# EAGLE schematic remote_v0.9.a8132eb9 (EAGLE 7.7.0)
I2C Bus Components - Dual DAC - Voltage Monitoring - Temperature Sensors - I/O Expander
VERSION: V0.1
Assembly variants: Beta, Min

## Sheet 1 of 4
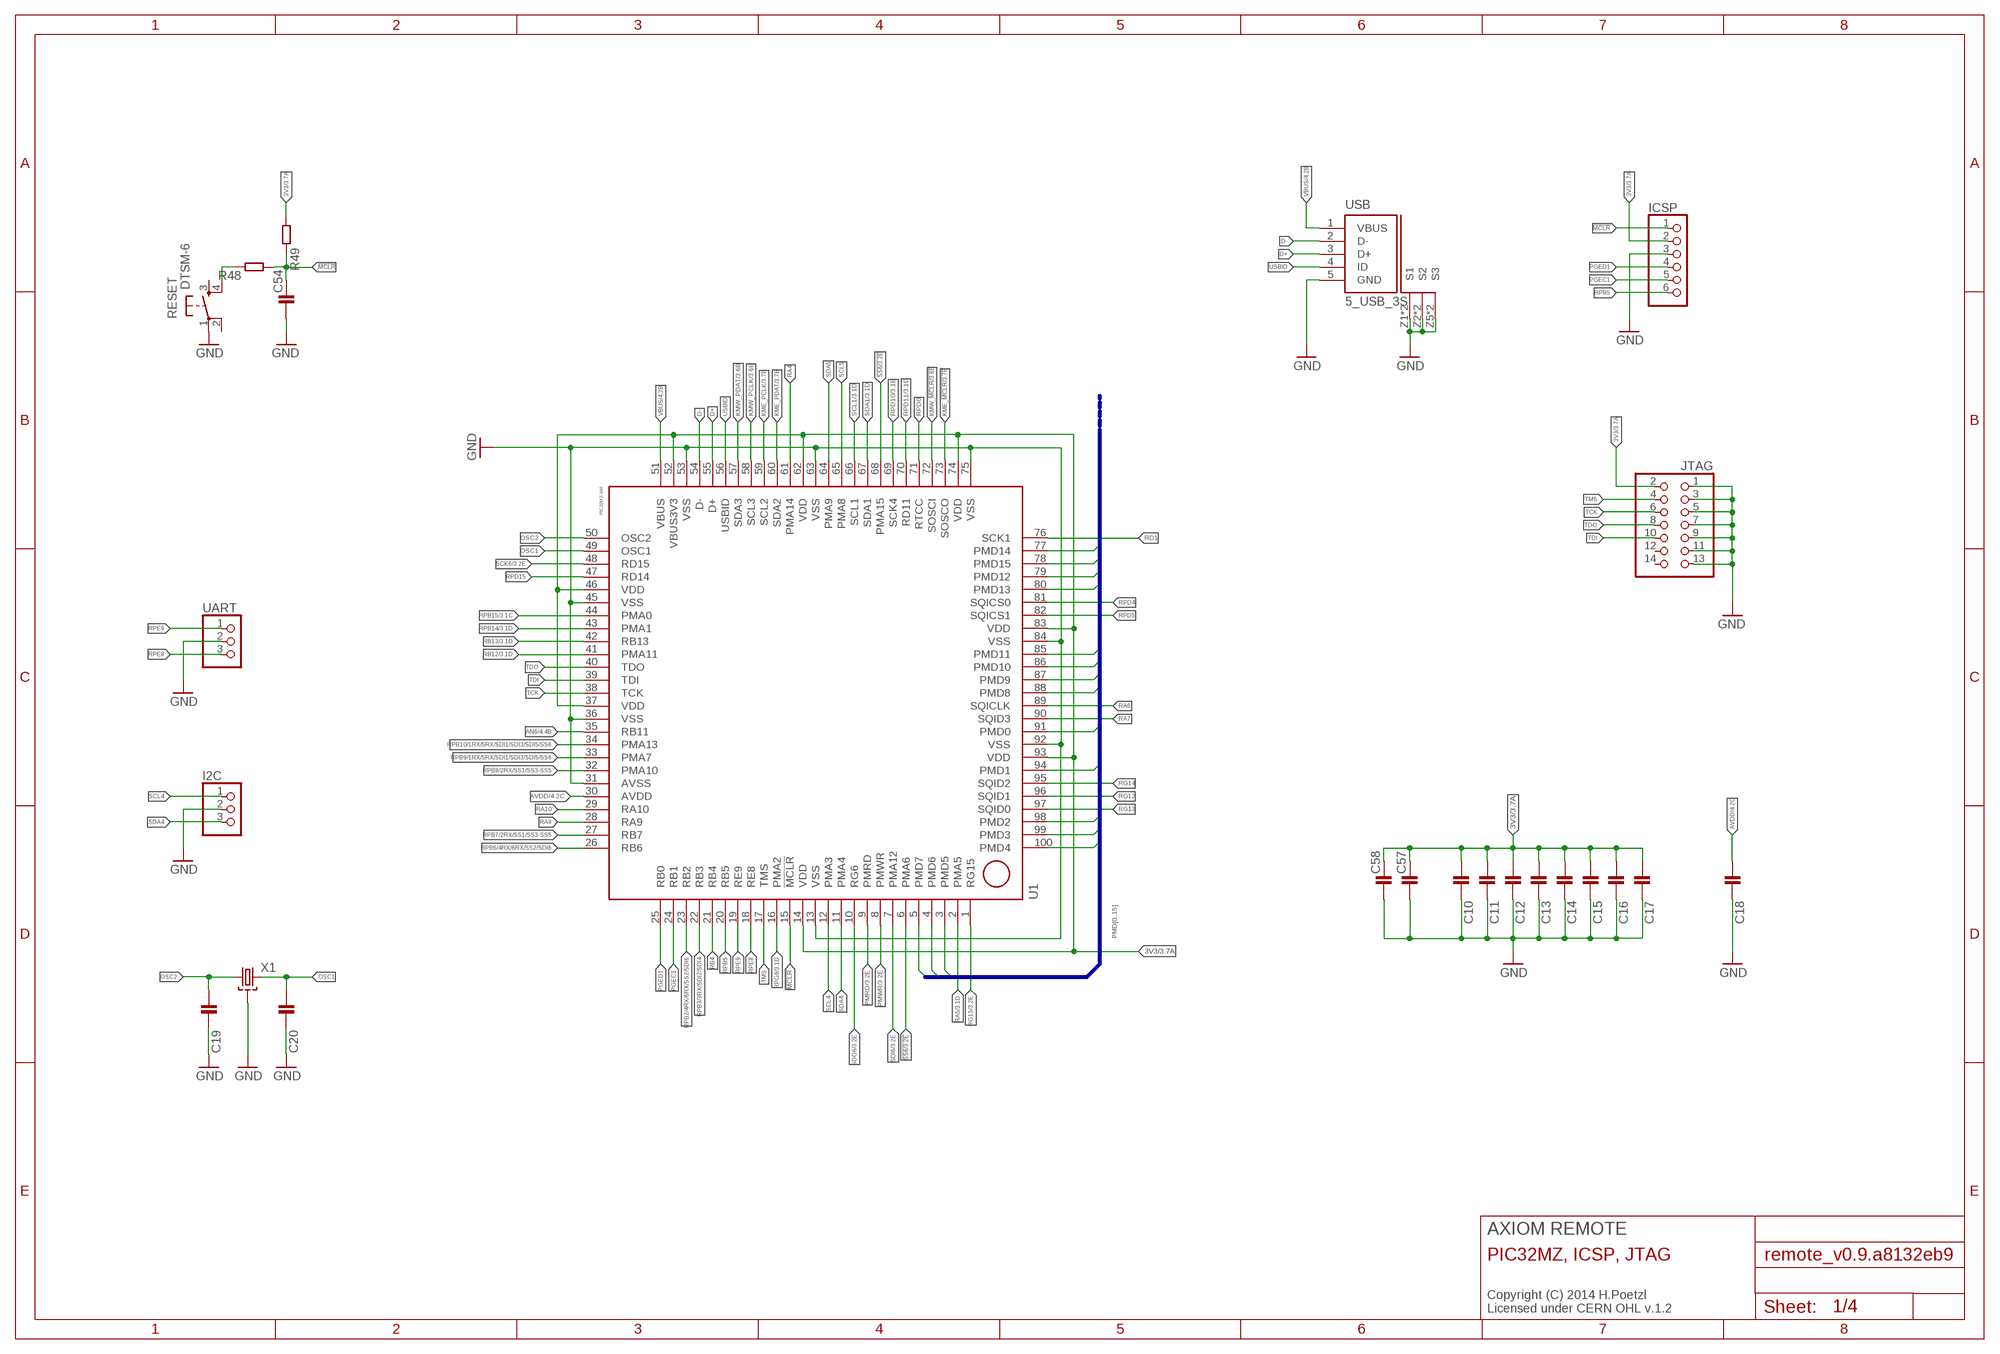
[diagram p0: schematic, sheet 1]

### Parts
C10  100n  C0402-C  [0402-C]
C11  100n  C0402-C  [0402-C]
C12  100n  C0402-C  [0402-C]
C13  100n  C0402-C  [0402-C]
C14  100n  C0402-C  [0402-C]
C15  100n  C0402-C  [0402-C]
C16  100n  C0402-C  [0402-C]
C17  100n  C0402-C  [0402-C]
C18  100n  C0402-C  [0402-C]
C19  100n  C0402-C  [0402-C]
C20  100n  C0402-C  [0402-C]
C54  C0402-C  [0402-C]
C57  C0805-C  [0805-C]
C58  C0805-C  [0805-C]
I2C  PINHD-1X03_2.54-90°  [1X03/90]
ICSP  PINHD-1X6/90  [1X06/90]
JTAG  PINHD-2X07_2.00  [2X07M]
R48  R0402-C  [0402-C]
R49  R0402-C  [0402-C]
RESET  DTSM-6  [3X4MM]
U1  PIC32MZ-100  [QFP40P1400X1400X120-100N]
UART  PINHD-1X03_2.54-90°  [1X03/90]
USB  5_USB_3S  [MICRO-AB-H-SMT]
X1  SMD-4P-2G-2.0X1.6  [2.0X1.6]

### Nets
3V3: C10.1 C11.1 C12.1 C13.1 C14.1 C15.1 C16.1 C17.1 C57.1 C58.1 ICSP.2 JTAG.2 R49.2 U1.14(VDD) U1.37(VDD) U1.46(VDD) U1.52(VBUS3V3) U1.62(VDD) U1.74(VDD) U1.83(VDD) U1.93(VDD) ; also sheet 3,4
!MCLR: C54.1 ICSP.1 R48.2 R49.1 U1.15(!MCLR)
!SS6: U1.6(PMA6) U1.68(PMA15) ; also sheet 3
AN6: U1.35(RB11) ; also sheet 4
AVDD: C18.1 U1.30(AVDD) ; also sheet 4
D+: U1.55(D+) USB.3(D+)
D-: U1.54(D-) USB.2(D-)
GND: C10.2 C11.2 C12.2 C13.2 C14.2 C15.2 C16.2 C17.2 C18.2 C19.2 C20.2 C54.2 C57.2 C58.2 I2C.2 ICSP.3 JTAG.1 JTAG.3 JTAG.5 JTAG.7 JTAG.9 JTAG.11 JTAG.13 RESET.1 U1.13(VSS) U1.31(AVSS) U1.36(VSS) U1.45(VSS) U1.53(VSS) U1.63(VSS) U1.75(VSS) U1.84(VSS) U1.92(VSS) UART.2 USB.5(GND) USB.Z1(S1) USB.Z2(S2) USB.Z3(S2) USB.Z4(S1) USB.Z5(S3) USB.Z6(S3) X1.2(GND) X1.4(GND) ; also sheet 2,3,4
KME_!MCLR: U1.73(SOSCO) ; also sheet 3
KME_PCLK: U1.59(SCL2) ; also sheet 3
KME_PDAT: U1.60(SDA2) ; also sheet 3
KMW_!MCLR: U1.72(SOSCI) ; also sheet 3
KMW_PCLK: U1.58(SCL3) ; also sheet 3
KMW_PDAT: U1.57(SDA3) ; also sheet 3
N$45: R48.1 RESET.4
OSC1: C20.1 U1.49(OSC1) X1.3
OSC2: C19.1 U1.50(OSC2) X1.1
PGEC1: ICSP.5 U1.24(RB1)
PGED1: ICSP.4 U1.25(RB0)
PMD0: U1.91(PMD0) ; also sheet 3
PMD1: U1.94(PMD1) ; also sheet 3
PMD2: U1.98(PMD2) ; also sheet 3
PMD3: U1.99(PMD3) ; also sheet 3
PMD4: U1.100(PMD4) ; also sheet 3
PMD5: U1.3(PMD5) ; also sheet 3
PMD6: U1.4(PMD6) ; also sheet 3
PMD7: U1.5(PMD7) ; also sheet 3
PMD8: U1.88(PMD8) ; also sheet 3
PMD9: U1.87(PMD9) ; also sheet 3
PMD10: U1.86(PMD10) ; also sheet 3
PMD11: U1.85(PMD11) ; also sheet 3
PMD12: U1.79(PMD12) ; also sheet 3
PMD13: U1.80(PMD13) ; also sheet 3
PMD14: U1.77(PMD14) ; also sheet 3
PMD15: U1.78(PMD15) ; also sheet 3
PMRD: U1.9(PMRD) ; also sheet 3
PMWR: U1.8(PMWR) ; also sheet 3
RA4: U1.61(PMA14)
RA5: U1.2(PMA5) ; also sheet 3
RA6: U1.89(SQICLK)
RA7: U1.90(SQID3)
RA9: U1.28(RA9)
RA10: U1.29(RA10)
RB4: U1.21(RB4)
RB12: U1.41(PMA11) ; also sheet 3
RB13: U1.42(RB13) ; also sheet 3
RD1: U1.76(SCK1)
RG12: U1.96(SQID1)
RG13: U1.97(SQID0)
RG14: U1.95(SQID2)
RG15: U1.1(RG15) ; also sheet 3
RPB2/4RX/6RX/SS2/SDI6: U1.23(RB2)
RPB3/3RX/SDI2/SDI4: U1.22(RB3)
RPB5: ICSP.6 U1.20(RB5)
RPB6/4RX/6RX/SS2/SDI6: U1.26(RB6)
RPB7/2RX/SS1/SS3-SS5: U1.27(RB7)
RPB8/2RX/SS1/SS3-SS5: U1.32(PMA10)
RPB9/1RX/5RX/SDI1/SDI3/SDI5/SS6: U1.33(PMA7)
RPB10/1RX/5RX/SDI1/SDI3/SDI5/SS6: U1.34(PMA13)
RPB14: U1.43(PMA1) ; also sheet 3
RPB15: U1.44(PMA0) ; also sheet 3
RPD0: U1.71(RTCC)
RPD4: U1.81(SQICS0)
RPD5: U1.82(SQICS1)
RPD10: U1.69(SCK4) ; also sheet 3
RPD11: U1.70(RD11) ; also sheet 3
RPD15: U1.47(RD14)
RPE8: U1.18(RE8) UART.3
RPE9: U1.19(RE9) UART.1
RPG9: U1.16(PMA2) ; also sheet 3
SCK6: U1.48(RD15) ; also sheet 3
SCL1: U1.66(SCL1) ; also sheet 3
SCL4: I2C.1 U1.12(PMA3)
SCL5: U1.65(PMA8)
SDA1: U1.67(SDA1) ; also sheet 3
SDA4: I2C.3 U1.11(PMA4)
SDA5: U1.64(PMA9)
SDI6: U1.7(PMA12) ; also sheet 3
SDO6: U1.10(RG6) ; also sheet 3
TCK: JTAG.6 U1.38(TCK)
TDI: JTAG.10 U1.39(TDI)
TDO: JTAG.8 U1.40(TDO)
TMS: JTAG.4 U1.17(TMS)
USBID: U1.56(USBID) USB.4(ID)
VBUS: U1.51(VBUS) USB.1(VBUS) ; also sheet 4
Unconnected: JTAG.12 JTAG.14 RESET.2 RESET.3

### Buses
PMD[0..15]

### Notes on the sheet
- AXIOM REMOTE
- PIC32MZ, ICSP, JTAG
- Copyright (C) 2014 H.Poetzl
  Licensed under CERN OHL v.1.2

## Sheet 2 of 4
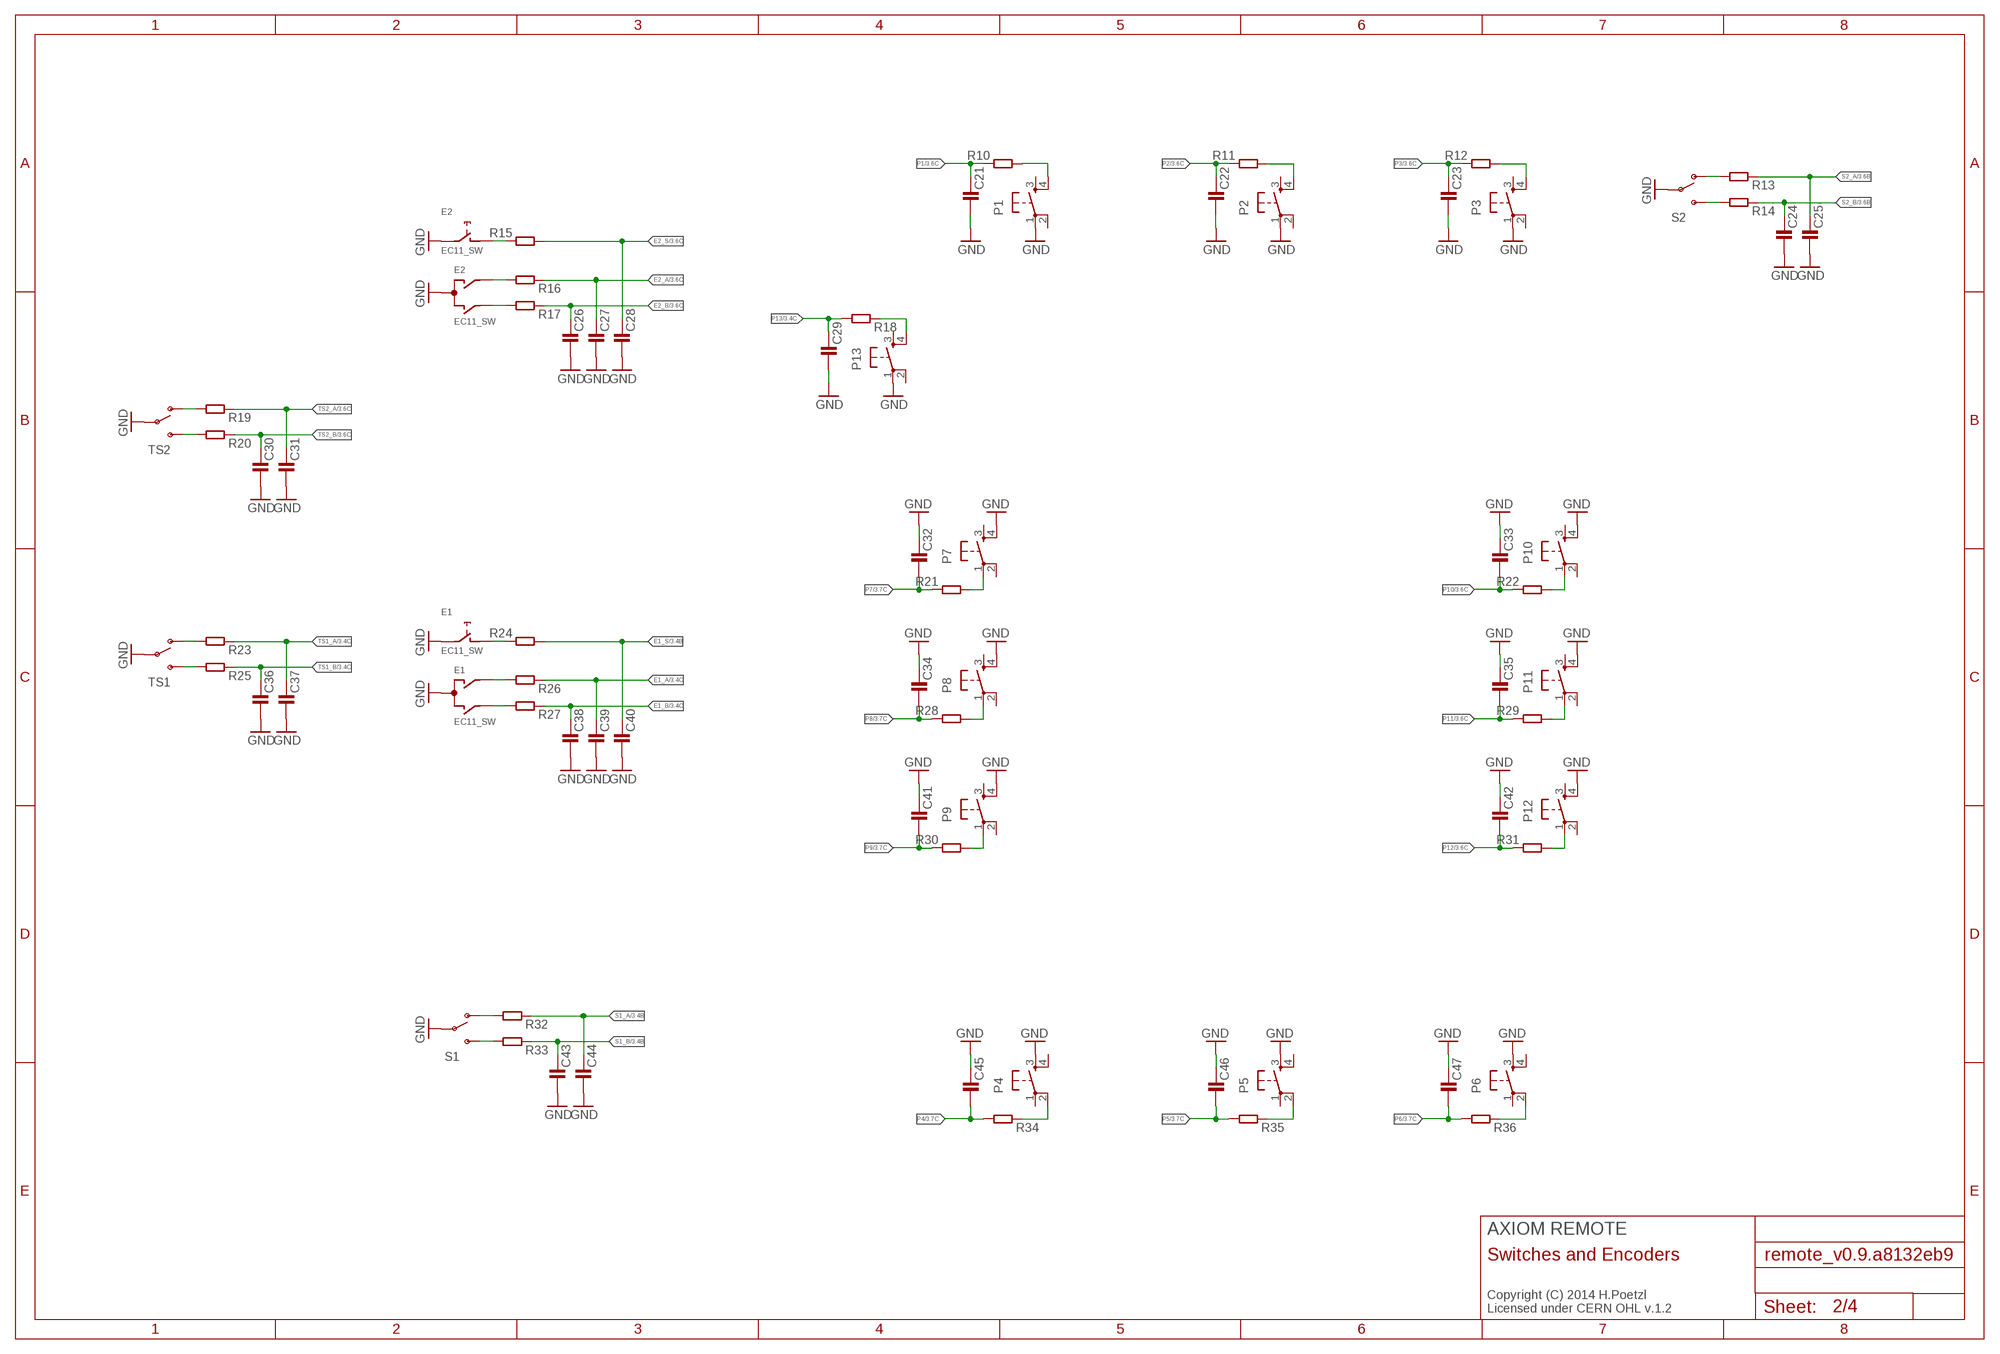
[diagram p1: schematic, sheet 2]

### Parts
C21  C0402-C  [0402-C]
C22  C0402-C  [0402-C]
C23  C0402-C  [0402-C]
C24  C0402-C  [0402-C]
C25  C0402-C  [0402-C]
C26  C0402-C  [0402-C]
C27  C0402-C  [0402-C]
C28  C0402-C  [0402-C]
C29  C0402-C  [0402-C]
C30  C0402-C  [0402-C]
C31  C0402-C  [0402-C]
C32  C0402-C  [0402-C]
C33  C0402-C  [0402-C]
C34  C0402-C  [0402-C]
C35  C0402-C  [0402-C]
C36  C0402-C  [0402-C]
C37  C0402-C  [0402-C]
C38  C0402-C  [0402-C]
C39  C0402-C  [0402-C]
C40  C0402-C  [0402-C]
C41  C0402-C  [0402-C]
C42  C0402-C  [0402-C]
C43  C0402-C  [0402-C]
C44  C0402-C  [0402-C]
C45  C0402-C  [0402-C]
C46  C0402-C  [0402-C]
C47  C0402-C  [0402-C]
E1  EC11_SW  [EC11_SW]
E2  EC11_SW  [EC11_SW]
P1  DTSM-6THT  [6X6-THT]
P2  DTSM-6THT  [6X6-THT]
P3  DTSM-6THT  [6X6-THT]
P4  DTSM-6THT  [6X6-THT]
P5  DTSM-6THT  [6X6-THT]
P6  DTSM-6THT  [6X6-THT]
P7  DTSM-6THT  [6X6-THT]
P8  DTSM-6THT  [6X6-THT]
P9  DTSM-6THT  [6X6-THT]
P10  DTSM-6THT  [6X6-THT]
P11  DTSM-6THT  [6X6-THT]
P12  DTSM-6THT  [6X6-THT]
P13  DTSM-6THT  [6X6-THT]
R10  R0402-C  [0402-C]
R11  R0402-C  [0402-C]
R12  R0402-C  [0402-C]
R13  R0402-C  [0402-C]
R14  R0402-C  [0402-C]
R15  R0402-C  [0402-C]
R16  R0402-C  [0402-C]
R17  R0402-C  [0402-C]
R18  R0402-C  [0402-C]
R19  R0402-C  [0402-C]
R20  R0402-C  [0402-C]
R21  R0402-C  [0402-C]
R22  R0402-C  [0402-C]
R23  R0402-C  [0402-C]
R24  R0402-C  [0402-C]
R25  R0402-C  [0402-C]
R26  R0402-C  [0402-C]
R27  R0402-C  [0402-C]
R28  R0402-C  [0402-C]
R29  R0402-C  [0402-C]
R30  R0402-C  [0402-C]
R31  R0402-C  [0402-C]
R32  R0402-C  [0402-C]
R33  R0402-C  [0402-C]
R34  R0402-C  [0402-C]
R35  R0402-C  [0402-C]
R36  R0402-C  [0402-C]
S1  SWITCH-SPDTTHT  [1101M2S3CBE2]
S2  SWITCH-SPDTTHT-RA  [1101M2S3ABE2]
TS1  SWITCH-SPDTSTG-RA  [200SPXTXBXM6]
TS2  SWITCH-SPDTSTG-RA  [200SPXTXBXM6]

### Nets
E1_A: C39.1 R26.1 ; also sheet 3
E1_B: C38.1 R27.1 ; also sheet 3
E1_S: C40.1 R24.2 ; also sheet 3
E2_A: C27.1 R16.1 ; also sheet 3
E2_B: C26.1 R17.1 ; also sheet 3
E2_S: C28.1 R15.2 ; also sheet 3
GND: C21.2 C22.2 C23.2 C24.2 C25.2 C26.2 C27.2 C28.2 C29.2 C30.2 C31.2 C32.1 C33.1 C34.1 C35.1 C36.2 C37.2 C38.2 C39.2 C40.2 C41.1 C42.1 C43.2 C44.2 C45.1 C46.1 C47.1 E1.C(E:C) E1.E E2.C(E:C) E2.E P1.1 P2.1 P3.1 P4.3 P5.3 P6.3 P7.4 P8.4 P9.4 P10.4 P11.4 P12.4 P13.1 S1.2(P) S2.2(P) TS1.2(P) TS2.2(P) ; also sheet 1,3,4
N$2: E2.A(E:A) R16.2
N$3: P1.4 R10.2
N$5: E2.B(E:B) R17.2
N$6: P2.4 R11.2
N$7: P3.4 R12.2
N$8: E2.D R15.1
N$10: R19.2 TS2.1(O)
N$11: R20.2 TS2.3(S)
N$13: R23.2 TS1.1(O)
N$14: R25.2 TS1.3(S)
N$15: R13.2 S2.1(O)
N$16: R14.2 S2.3(S)
N$17: E1.A(E:A) R26.2
N$18: E1.B(E:B) R27.2
N$19: E1.D R24.1
N$20: R32.2 S1.1(O)
N$21: R33.2 S1.3(S)
N$22: P4.2 R34.1
N$23: P5.2 R35.1
N$24: P6.2 R36.1
N$25: P9.1 R30.2
N$26: P12.1 R31.2
N$27: P8.1 R28.2
N$28: P11.1 R29.2
N$29: P7.1 R21.2
N$30: P10.1 R22.2
N$43: P13.4 R18.1
P1: C21.1 R10.1 ; also sheet 3
P2: C22.1 R11.1 ; also sheet 3
P3: C23.1 R12.1 ; also sheet 3
P4: C45.2 R34.2 ; also sheet 3
P5: C46.2 R35.2 ; also sheet 3
P6: C47.2 R36.2 ; also sheet 3
P7: C32.2 R21.1 ; also sheet 3
P8: C34.2 R28.1 ; also sheet 3
P9: C41.2 R30.1 ; also sheet 3
P10: C33.2 R22.1 ; also sheet 3
P11: C35.2 R29.1 ; also sheet 3
P12: C42.2 R31.1 ; also sheet 3
P13: C29.1 R18.2 ; also sheet 3
S1_A: C44.1 R32.1 ; also sheet 3
S1_B: C43.1 R33.1 ; also sheet 3
S2_A: C25.1 R13.1 ; also sheet 3
S2_B: C24.1 R14.1 ; also sheet 3
TS1_A: C37.1 R23.1 ; also sheet 3
TS1_B: C36.1 R25.1 ; also sheet 3
TS2_A: C31.1 R19.1 ; also sheet 3
TS2_B: C30.1 R20.1 ; also sheet 3
Unconnected: E1.GND1(GND1:G) E1.GND2(GND2:G) E2.GND1(GND1:G) E2.GND2(GND2:G) P1.2 P1.3 P2.2 P2.3 P3.2 P3.3 P4.1 P4.4 P5.1 P5.4 P6.1 P6.4 P7.2 P7.3 P8.2 P8.3 P9.2 P9.3 P10.2 P10.3 P11.2 P11.3 P12.2 P12.3 P13.2 P13.3

### Notes on the sheet
- AXIOM REMOTE
- Switches and Encoders
- Copyright (C) 2014 H.Poetzl
  Licensed under CERN OHL v.1.2

## Sheet 3 of 4
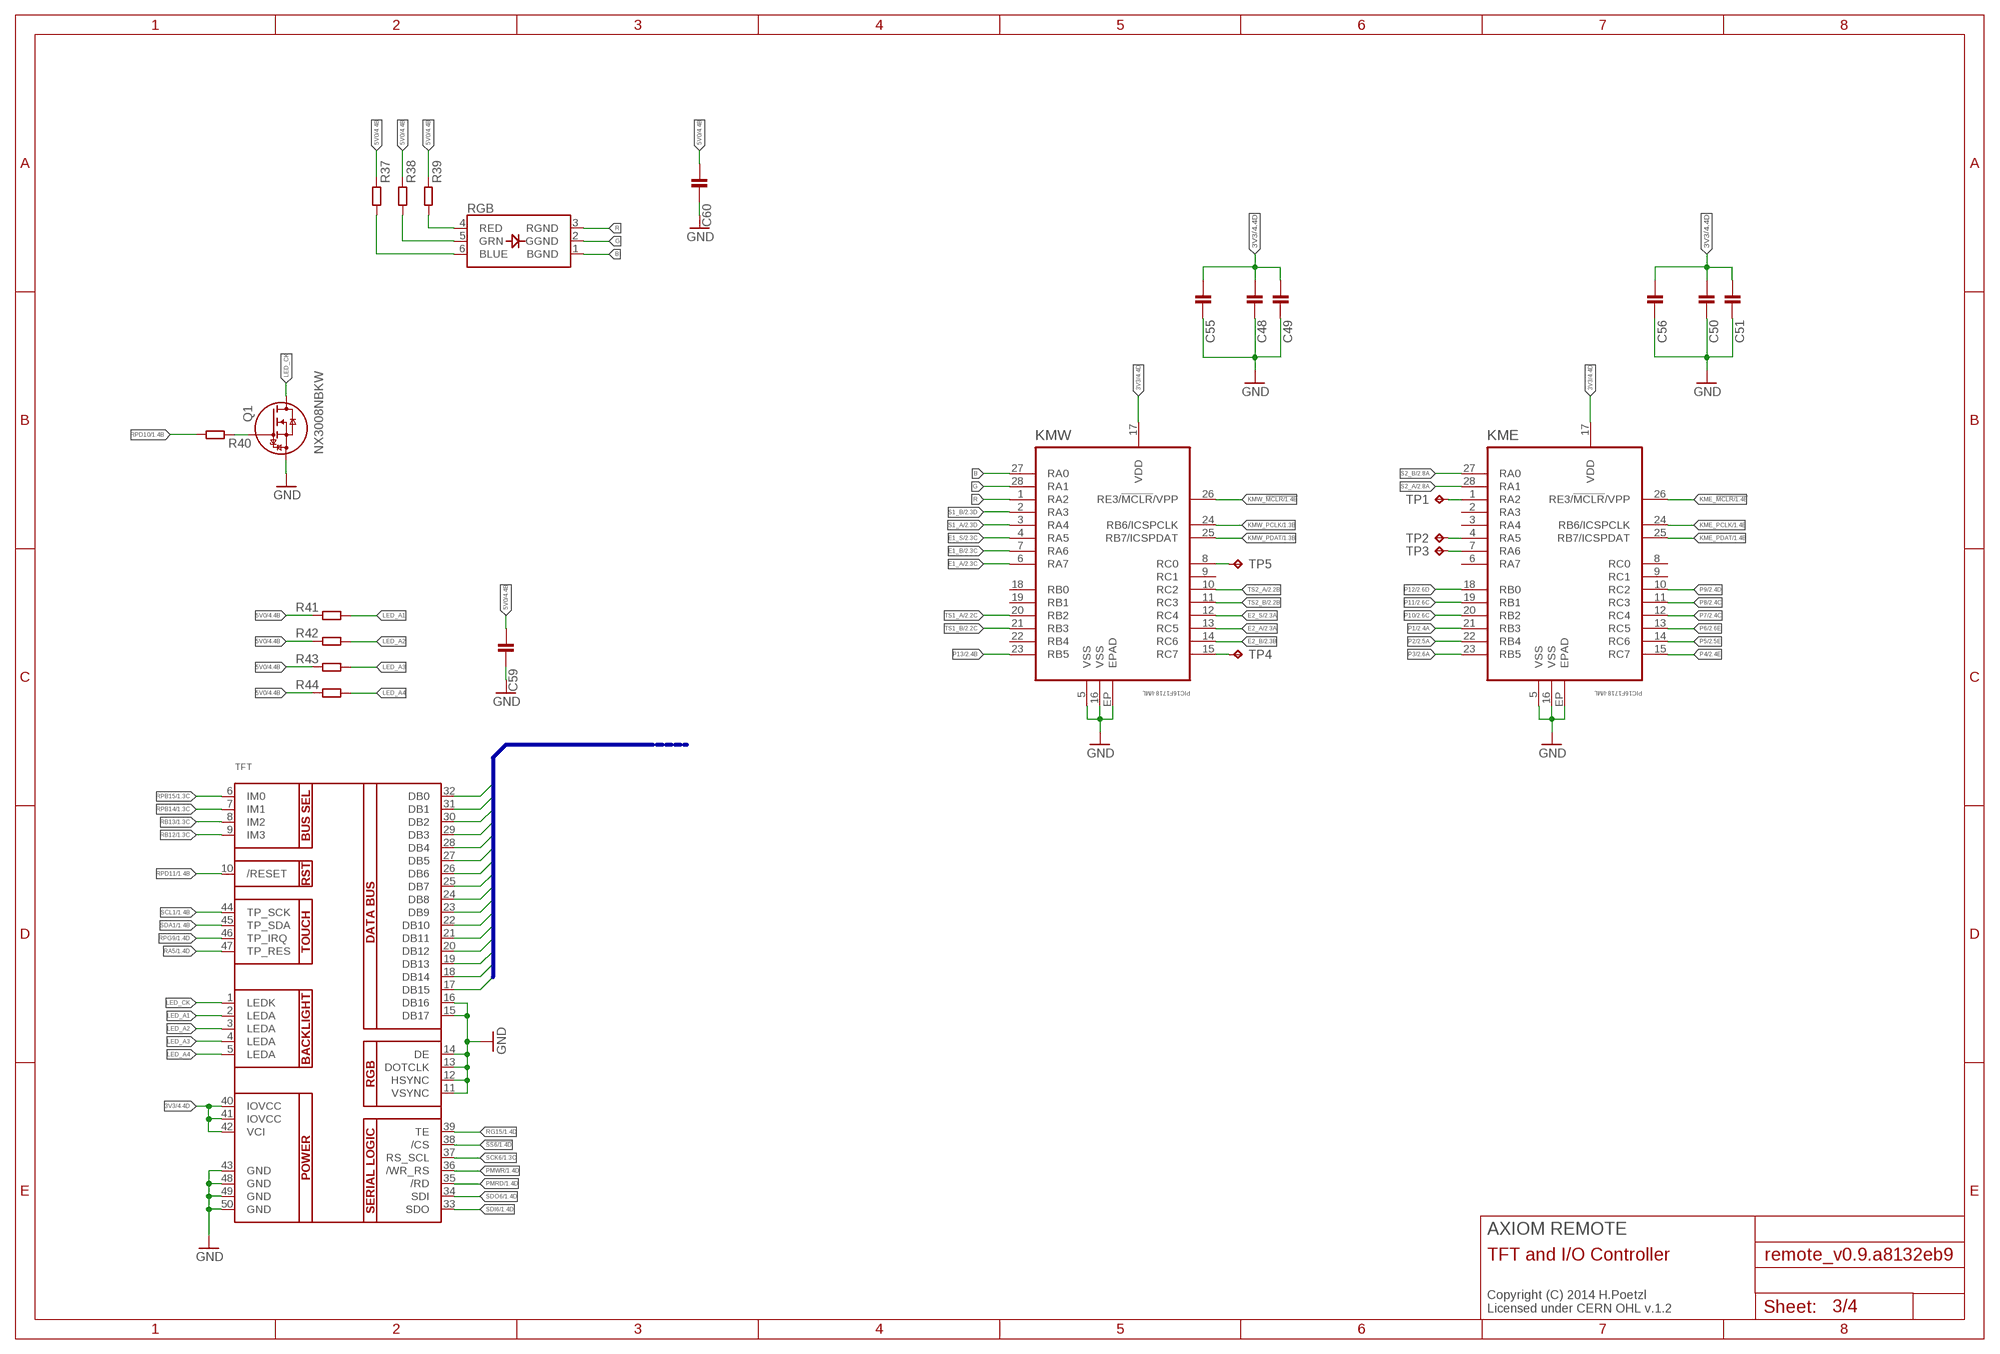
[diagram p2: schematic, sheet 3]

### Parts
C48  100n  C0402-C  [0402-C]
C49  100n  C0402-C  [0402-C]
C50  100n  C0402-C  [0402-C]
C51  100n  C0402-C  [0402-C]
C55  100n  C0805-C  [0805-C]
C56  100n  C0805-C  [0805-C]
C59  100n  C0805-C  [0805-C]
C60  100n  C0805-C  [0805-C]
KME  PIC16F1718-I/ML  [QFN65P600X600X100-29N]
KMW  PIC16F1718-I/ML  [QFN65P600X600X100-29N]
Q1  NX3008NBKW  [SOT323]
R37  R0603-C  [0603-C]
R38  R0603-C  [0603-C]
R39  R0603-C  [0603-C]
R40  R0402-C  [0402-C]
R41  R0805-C  [0805-C]
R42  R0805-C  [0805-C]
R43  R0805-C  [0805-C]
R44  R0805-C  [0805-C]
RGB  LED_RGB_PLCC6CREE-CLV6A  [RGBLED_PLCC6]
TFT  DISP_LCD_CTP28_SAMPLE  [TFT_2.83IN_240X320_50PIN]
TP1  TPTP12R  [TP12R]
TP2  TPTP12R  [TP12R]
TP3  TPTP12R  [TP12R]
TP4  TPTP12R  [TP12R]
TP5  TPTP12R  [TP12R]

### Nets
3V3: C48.1 C49.1 C50.1 C51.1 C55.1 C56.1 KME.17(VDD) KMW.17(VDD) TFT.40(IOVCC) TFT.41(IOVCC) TFT.42(VCI) ; also sheet 1,4
5V0: C59.1 C60.1 R37.1 R38.1 R39.1 R41.1 R42.1 R43.1 R44.1 ; also sheet 4
!SS6: TFT.38(/CS) ; also sheet 1
B: KMW.27(RA0) RGB.1(BGND)
E1_A: KMW.6(RA7) ; also sheet 2
E1_B: KMW.7(RA6) ; also sheet 2
E1_S: KMW.4(RA5) ; also sheet 2
E2_A: KMW.13(RC5) ; also sheet 2
E2_B: KMW.14(RC6) ; also sheet 2
E2_S: KMW.12(RC4) ; also sheet 2
G: KMW.28(RA1) RGB.2(GGND)
GND: C48.2 C49.2 C50.2 C51.2 C55.2 C56.2 C59.2 C60.2 KME.5(VSS) KME.16(VSS) KME.EP(EPAD) KMW.5(VSS) KMW.16(VSS) KMW.EP(EPAD) Q1.2(S) TFT.11(VSYNC) TFT.12(HSYNC) TFT.13(DOTCLK) TFT.14(DE) TFT.15(DB17) TFT.16(DB16) TFT.43(GND) TFT.48(GND) TFT.49(GND) TFT.50(GND) ; also sheet 1,2,4
KME_!MCLR: KME.26(RE3/!MCLR!/VPP) ; also sheet 1
KME_PCLK: KME.24(RB6/ICSPCLK) ; also sheet 1
KME_PDAT: KME.25(RB7/ICSPDAT) ; also sheet 1
KMW_!MCLR: KMW.26(RE3/!MCLR!/VPP) ; also sheet 1
KMW_PCLK: KMW.24(RB6/ICSPCLK) ; also sheet 1
KMW_PDAT: KMW.25(RB7/ICSPDAT) ; also sheet 1
LED_A1: R41.2 TFT.2(LEDA)
LED_A2: R42.2 TFT.3(LEDA)
LED_A3: R43.2 TFT.4(LEDA)
LED_A4: R44.2 TFT.5(LEDA)
LED_CK: Q1.3(D) TFT.1(LEDK)
N$33: KMW.8(RC0) TP5.TP
N$34: R39.2 RGB.4(RED)
N$35: R38.2 RGB.5(GRN)
N$37: KME.1(RA2) TP1.TP
N$38: KME.7(RA6) TP3.TP
N$39: KME.4(RA5) TP2.TP
N$41: R37.2 RGB.6(BLUE)
N$44: KMW.15(RC7) TP4.TP
N$46: Q1.1(G) R40.1
P1: KME.21(RB3) ; also sheet 2
P2: KME.22(RB4) ; also sheet 2
P3: KME.23(RB5) ; also sheet 2
P4: KME.15(RC7) ; also sheet 2
P5: KME.14(RC6) ; also sheet 2
P6: KME.13(RC5) ; also sheet 2
P7: KME.12(RC4) ; also sheet 2
P8: KME.11(RC3) ; also sheet 2
P9: KME.10(RC2) ; also sheet 2
P10: KME.20(RB2) ; also sheet 2
P11: KME.19(RB1) ; also sheet 2
P12: KME.18(RB0) ; also sheet 2
P13: KMW.23(RB5) ; also sheet 2
PMD0: TFT.32(DB0) ; also sheet 1
PMD1: TFT.31(DB1) ; also sheet 1
PMD2: TFT.30(DB2) ; also sheet 1
PMD3: TFT.29(DB3) ; also sheet 1
PMD4: TFT.28(DB4) ; also sheet 1
PMD5: TFT.27(DB5) ; also sheet 1
PMD6: TFT.26(DB6) ; also sheet 1
PMD7: TFT.25(DB7) ; also sheet 1
PMD8: TFT.24(DB8) ; also sheet 1
PMD9: TFT.23(DB9) ; also sheet 1
PMD10: TFT.22(DB10) ; also sheet 1
PMD11: TFT.21(DB11) ; also sheet 1
PMD12: TFT.20(DB12) ; also sheet 1
PMD13: TFT.19(DB13) ; also sheet 1
PMD14: TFT.18(DB14) ; also sheet 1
PMD15: TFT.17(DB15) ; also sheet 1
PMRD: TFT.35(/RD) ; also sheet 1
PMWR: TFT.36(/WR_RS) ; also sheet 1
R: KMW.1(RA2) RGB.3(RGND)
RA5: TFT.47(TP_RES) ; also sheet 1
RB12: TFT.9(IM3) ; also sheet 1
RB13: TFT.8(IM2) ; also sheet 1
RG15: TFT.39(TE) ; also sheet 1
RPB14: TFT.7(IM1) ; also sheet 1
RPB15: TFT.6(IM0) ; also sheet 1
RPD10: R40.2 ; also sheet 1
RPD11: TFT.10(/RESET) ; also sheet 1
RPG9: TFT.46(TP_IRQ) ; also sheet 1
S1_A: KMW.3(RA4) ; also sheet 2
S1_B: KMW.2(RA3) ; also sheet 2
S2_A: KME.28(RA1) ; also sheet 2
S2_B: KME.27(RA0) ; also sheet 2
SCK6: TFT.37(RS_SCL) ; also sheet 1
SCL1: TFT.44(TP_SCK) ; also sheet 1
SDA1: TFT.45(TP_SDA) ; also sheet 1
SDI6: TFT.33(SDO) ; also sheet 1
SDO6: TFT.34(SDI) ; also sheet 1
TS1_A: KMW.20(RB2) ; also sheet 2
TS1_B: KMW.21(RB3) ; also sheet 2
TS2_A: KMW.10(RC2) ; also sheet 2
TS2_B: KMW.11(RC3) ; also sheet 2
Unconnected: KME.2(RA3) KME.3(RA4) KME.6(RA7) KME.8(RC0) KME.9(RC1) KMW.9(RC1) KMW.18(RB0) KMW.19(RB1) KMW.22(RB4)

### Buses
PMD[0..15]

### Notes on the sheet
- AXIOM REMOTE
- TFT and I/O Controller
- Copyright (C) 2014 H.Poetzl
  Licensed under CERN OHL v.1.2

## Sheet 4 of 4
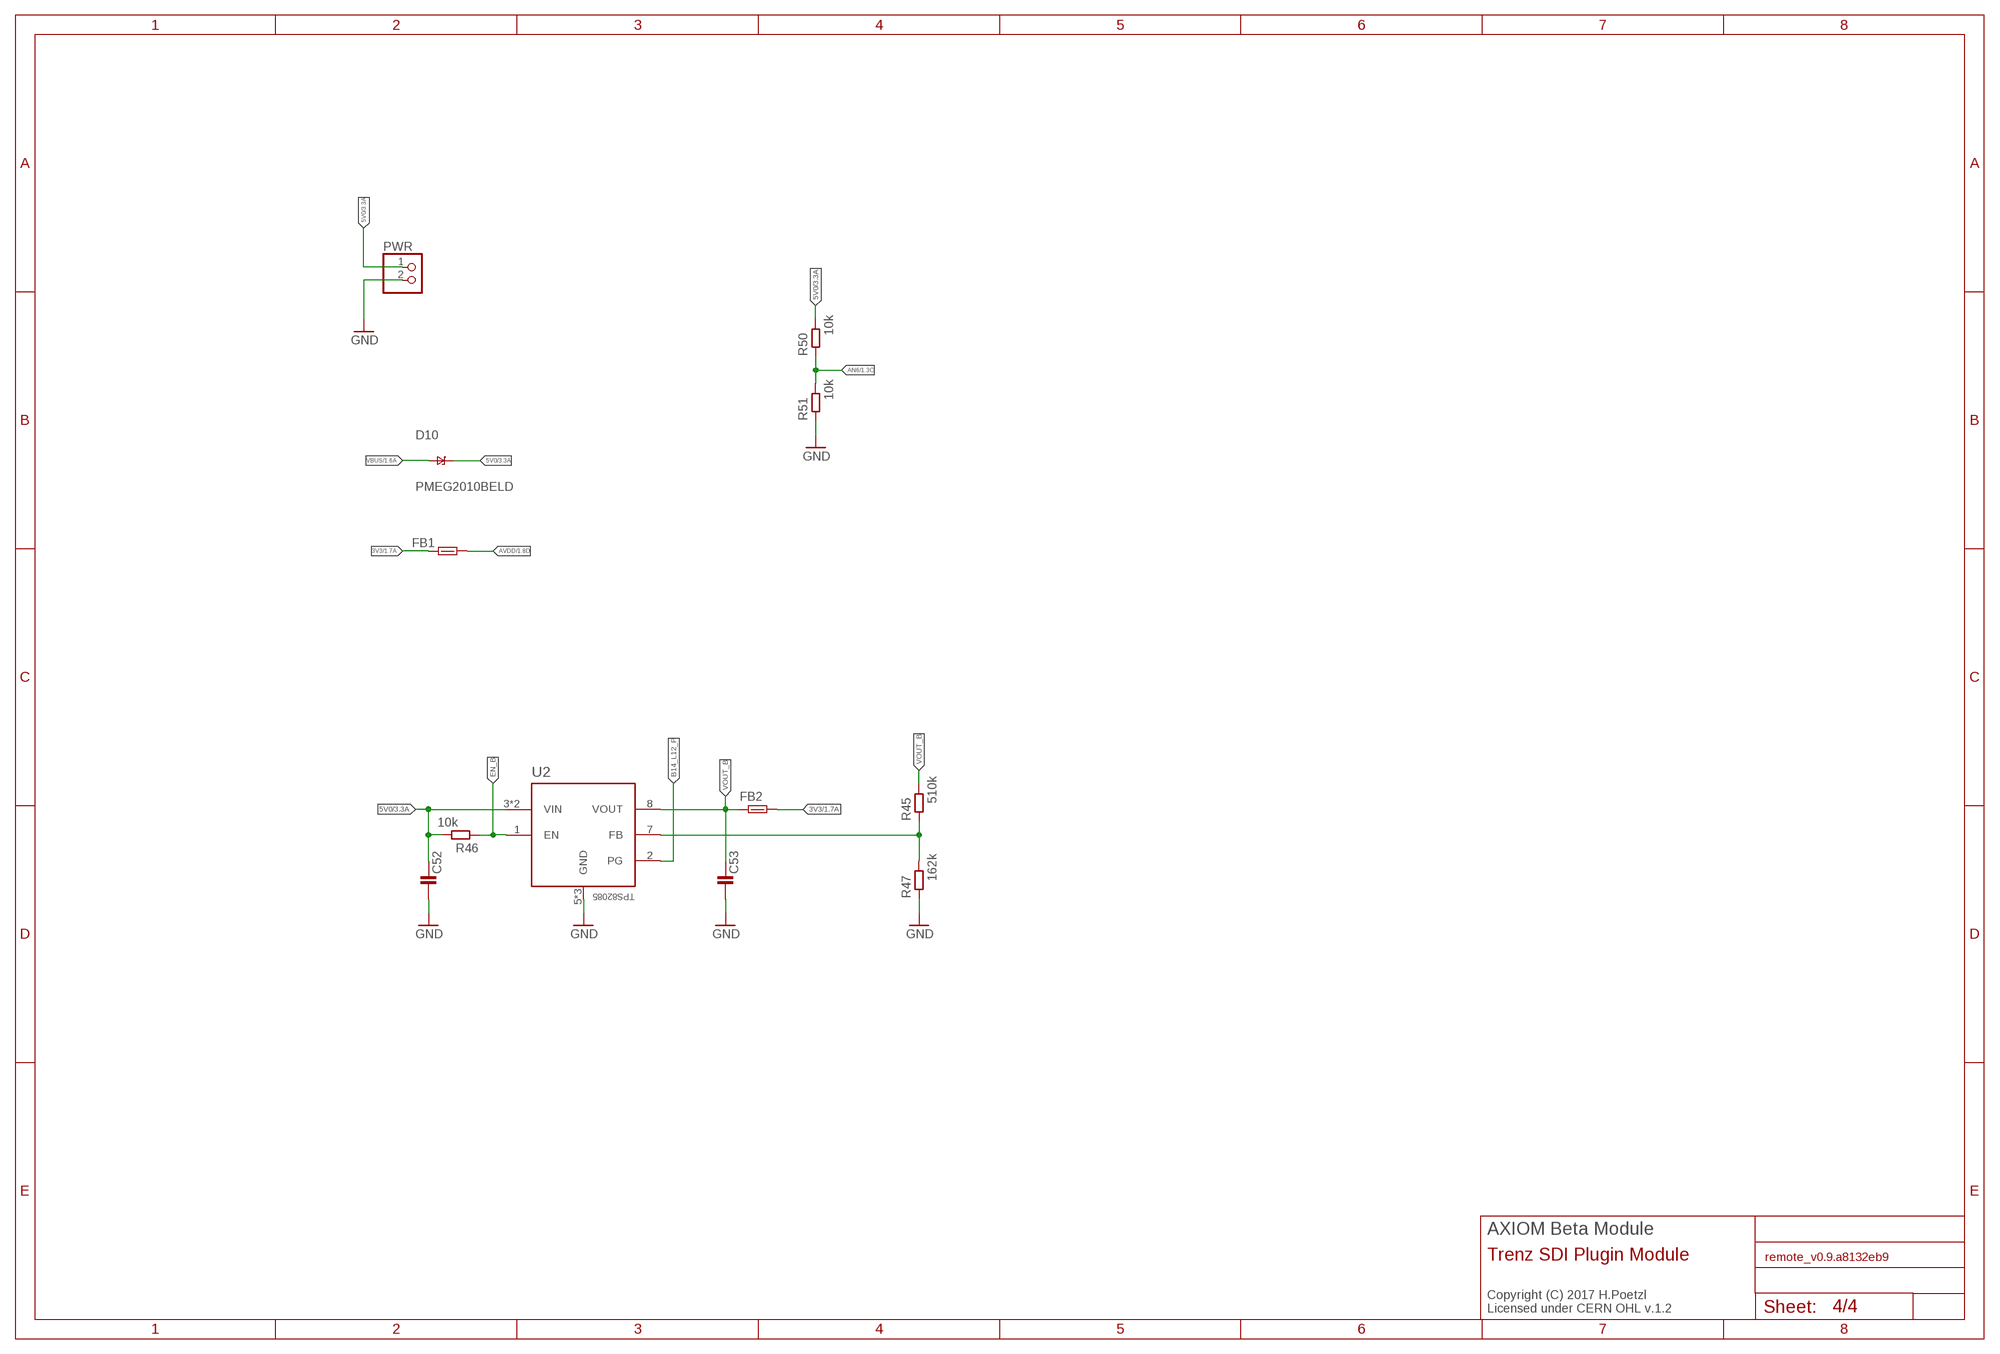
[diagram p3: schematic, sheet 4]

### Parts
C52  C0603-C  [0603-C]
C53  C0603-C  [0603-C]
D10  PMEG2010BELD  [DFN1006D-2]
FB1  FB0402-C  [0402-C]
FB2  FB0603-C  [0603-C]
PWR  PINHD-1X02_2.54-90°  [1X02/90]
R45  510k  R0201-C  [0201-C]
R46  10k  R0201-C  [0201-C]
R47  162k  R0201-C  [0201-C]
R50  10k  R0402-C  [0402-C]
R51  10k  R0402-C  [0402-C]
U2  TPS82085  [MICROSIP]

### Nets
3V3: FB1.1 FB2.2 ; also sheet 1,3
5V0: C52.1 D10.C(K) PWR.1 R46.2 R50.2 U2.3(VIN) U2.4(VIN) ; also sheet 3
AN6: R50.1 R51.2 ; also sheet 1
AVDD: FB1.2 ; also sheet 1
B14_L12_P: U2.2(PG)
EN_B: R46.1 U2.1(EN)
FB_B: R45.1 R47.2 U2.7(FB)
GND: C52.2 C53.2 PWR.2 R47.1 R51.1 U2.5(GND) U2.6(GND) U2.EP(GND) ; also sheet 1,2,3
VBUS: D10.A ; also sheet 1
VOUT_B: C53.1 FB2.1 R45.2 U2.8(VOUT)

### Notes on the sheet
- AXIOM Beta Module
- Trenz SDI Plugin Module
- Copyright (C) 2017 H.Poetzl
  Licensed under CERN OHL v.1.2

## Library data of the parts
C10-C60 = generic-rcl:C
D10 = pmeg2010beld:PMEG2010BELD
E1 E2 = encoder:EC11_SW: ALPS rotary Encoder EC11 series with switch
FB1 FB2 = generic-rcl:FB
I2C UART = pinhead-2:PINHD-1X03: PIN HEADER
ICSP = pinhead:PINHD-1X6: PIN HEADER
JTAG = pinhead-2:PINHD-2X07: PIN HEADER
KME KMW = pic16f1718:PIC16F1718: MCU, 8BIT, 14K FLASH, 28UQFN
P1-P13 RESET = switch:DTSM-6
PWR = pinhead-2:PINHD-1X02: PIN HEADER
Q1 = transistor:NX3008N: 30 V, single N-channel Trench MOSFET Herbert Poetzl
R10-R51 = generic-rcl:R
RGB = rgb_led:LED_RGB_PLCC6: RGB LED Cree CLV6A-FKB - Digikey: CLV6A-FKB-CK1P1G1BB7R3R3TR-ND DC Foreward Current: 20mA Foreward Voltage: R = 2.0, G = 3.2, B = 3.2 Viewing Angle: 120°
S1 S2 TS1 TS2 = switch:SWITCH-SPDT: SPST Switch Simple slide switch. Spark Fun Electronics SKU : COM-00102
TFT = tft:DISP_LCD_CTP28: 2.83" 240x320 Pixel Capacitive Touch Display
TP1-TP5 = testpad:TP: Test pad
U1 = pic32mz:PIC32MZ-100: IC, High-Performance,General Purpose and USB,32-bit Flash Microcontrollers,100-Lead TQFP
U2 = TPS82085:TPS82085: Buck/Boost Charge Pump 60mA
USB = usb:5_USB_3S
X1 = xtal:SMD-4P-2G

## Net classes
0 default: width 0.152 mm, drill 0.254 mm, clearance 0.152 mm